# Altium schematic sheet CrossPort.SchDoc: Cross Port
size 420 x 297 mm; DocumentNumber: 3; SheetNumber: 11; SheetTotal: 15
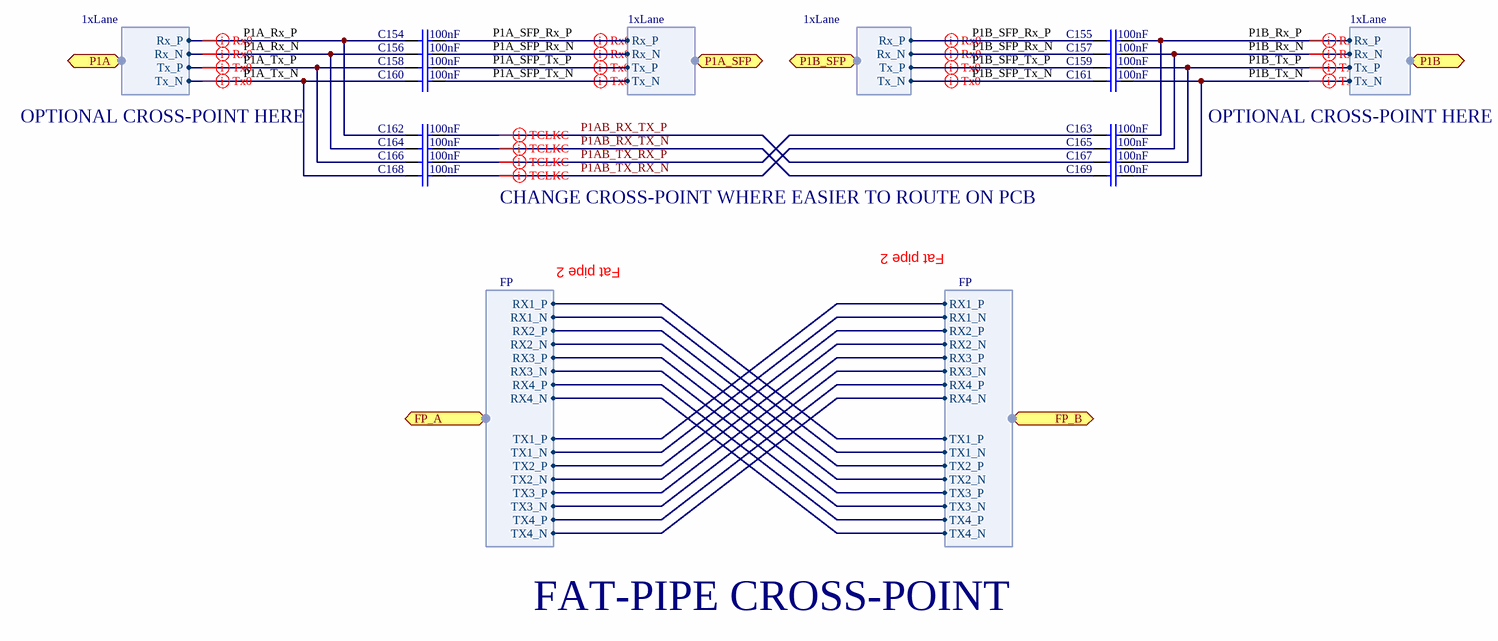
[diagram p0: CrossPort.SchDoc]

## Parts
C154  100nF  [CAPC0603X33N]
C155  100nF  [CAPC0603X33N]
C156  100nF  [CAPC0603X33N]
C157  100nF  [CAPC0603X33N]
C158  100nF  [CAPC0603X33N]
C159  100nF  [CAPC0603X33N]
C160  100nF  [CAPC0603X33N]
C161  100nF  [CAPC0603X33N]
C162  100nF  [CAPC0603X33N]
C163  100nF  [CAPC0603X33N]
C164  100nF  [CAPC0603X33N]
C165  100nF  [CAPC0603X33N]
C166  100nF  [CAPC0603X33N]
C167  100nF  [CAPC0603X33N]
C168  100nF  [CAPC0603X33N]
C169  100nF  [CAPC0603X33N]

## Ports
FP_A (harness FP), FP_B (harness FP), P1A (harness 1xLane), P1A_SFP (harness 1xLane), P1B (harness 1xLane), P1B_SFP (harness 1xLane)

## Harnesses
FP: RX1_P, RX1_N, RX2_N, RX2_P, TX1_P, TX1_N, TX2_N, TX2_P, RX3_P, RX3_N, RX4_N, RX4_P, TX3_P, TX3_N, TX4_N, TX4_P
1xLane: Rx_P, Rx_N, Tx_P, Tx_N

## Nets
P1A_Rx_N: C156.2 C164.2 ; port P1A.Rx_N
P1A_Rx_P: C154.2 C162.2 ; port P1A.Rx_P
P1A_SFP_Rx_N: C156.1 ; port P1A_SFP.Rx_N
P1A_SFP_Rx_P: C154.1 ; port P1A_SFP.Rx_P
P1A_SFP_Tx_N: C160.1 ; port P1A_SFP.Tx_N
P1A_SFP_Tx_P: C158.1 ; port P1A_SFP.Tx_P
P1A_Tx_N: C160.2 C168.2 ; port P1A.Tx_N
P1A_Tx_P: C158.2 C166.2 ; port P1A.Tx_P
P1AB_RX_TX_N: C164.1 C169.2
P1AB_RX_TX_P: C162.1 C167.2
P1AB_TX_RX_N: C165.2 C168.1
P1AB_TX_RX_P: C163.2 C166.1
P1B_Rx_N: C157.1 C165.1 ; port P1B.Rx_N
P1B_Rx_P: C155.1 C163.1 ; port P1B.Rx_P
P1B_SFP_Rx_N: C157.2 ; port P1B_SFP.Rx_N
P1B_SFP_Rx_P: C155.2 ; port P1B_SFP.Rx_P
P1B_SFP_Tx_N: C161.2 ; port P1B_SFP.Tx_N
P1B_SFP_Tx_P: C159.2 ; port P1B_SFP.Tx_P
P1B_Tx_N: C161.1 C169.1 ; port P1B.Tx_N
P1B_Tx_P: C159.1 C167.1 ; port P1B.Tx_P
(unnamed): port FP_A.RX1_P, port FP_B.TX1_P
(unnamed): port FP_A.RX1_N, port FP_B.TX1_N
(unnamed): port FP_A.RX2_N, port FP_B.TX2_N
(unnamed): port FP_A.RX2_P, port FP_B.TX2_P
(unnamed): port FP_A.TX1_P, port FP_B.RX1_P
(unnamed): port FP_A.TX1_N, port FP_B.RX1_N
(unnamed): port FP_A.TX2_N, port FP_B.RX2_N
(unnamed): port FP_A.TX2_P, port FP_B.RX2_P
(unnamed): port FP_A.RX3_P, port FP_B.TX3_P
(unnamed): port FP_A.RX3_N, port FP_B.TX3_N
(unnamed): port FP_A.RX4_N, port FP_B.TX4_N
(unnamed): port FP_A.RX4_P, port FP_B.TX4_P
(unnamed): port FP_A.TX3_P, port FP_B.RX3_P
(unnamed): port FP_A.TX3_N, port FP_B.RX3_N
(unnamed): port FP_A.TX4_N, port FP_B.RX4_N
(unnamed): port FP_A.TX4_P, port FP_B.RX4_P

## Layout directives
differential pair: P1A_Rx_N, P1A_Rx_P, P1A_SFP_Rx_N, P1A_SFP_Rx_P, P1A_SFP_Tx_N, P1A_SFP_Tx_P, P1A_Tx_N, P1A_Tx_P, P1AB_RX_TX_N, P1AB_RX_TX_P, P1AB_TX_RX_N, P1AB_TX_RX_P, P1B_Rx_N, P1B_Rx_P, P1B_SFP_Rx_N, P1B_SFP_Rx_P, P1B_SFP_Tx_N, P1B_SFP_Tx_P, P1B_Tx_N, P1B_Tx_P

## Notes on the sheet
- OPTIONAL CROSS-POINT HERE
- CHANGE CROSS-POINT WHERE EASIER TO ROUTE ON PCB
- Fat pipe 2
- FAT-PIPE CROSS-POINT
- Project/Equipment
- Document
- uTCA RTM 8 SFP+
- Designer
- Drawn by
- Check.by
- Copyright Creotech Instruments SA 2014.
  This documentation describes Open Hardware and is licensed under the CERN OHL v.1.1. You may redistribute and modify this documentation under the terms of the CERN OHL v.1.1. (http://ohwr.org/CERNOHL). This documentation is distributed WITHOUT ANY EXPRESS OR IMPLIED WARRANTY, INCLUDING OF MERCHANTABILITY, SATISFACTORY QUALITY AND FITNESS FOR A PARTICULAR PURPOSE. Please see the CERN OHL v.1.1 for applicable conditions.
- Creotech Instruments S.A.
- File
- Last Mod.
- Print Date
- Sheet
- Size
- A3
- of
- Rev

## Library data of the parts
C154-C169 = CC0201_100NF_6.3V_10%_X5R: Non-polarised capacitor; Part Description: SMD Multilayer Chip Ceramic Capacitor; Manufacturer: GENERIC; Manufacturer1 Part Number: 02016D104KAT2A; Voltage: 6.3V; TC: X5R; Tolerance: ±10%; Table: Capacitors SMD; Part Number: CC0201_100NF_6.3V_10%_X5R; Component Kind: Standard; Component Type: Standard; Pin Count: 2; Value: 100nF; Status: Not Recommended; Manufacturer Part Number: CC0201_100NF_6.3V_10%_X5R; Case: 0201; Mounted: Yes; Socket: No; SMD: Yes; Manufacturer1 Example: AVX; Manufacturer1 ComponentHeight: 0.33mm; HelpURL: \\cern.ch\dfs\Applications\Altium\Datasheets\CC0201_X5R_AVX.pdf; Author: CERN DEM JLC; CreateDate: 2007-12-03; LatestRevisionDate: 2007-12-03